# Altium schematic sheet Motor A Driver.SchDoc
size C; DrawnBy: Ross Harvey; Revision: A; SheetNumber: 2; ModifiedDate: 7/2/2015
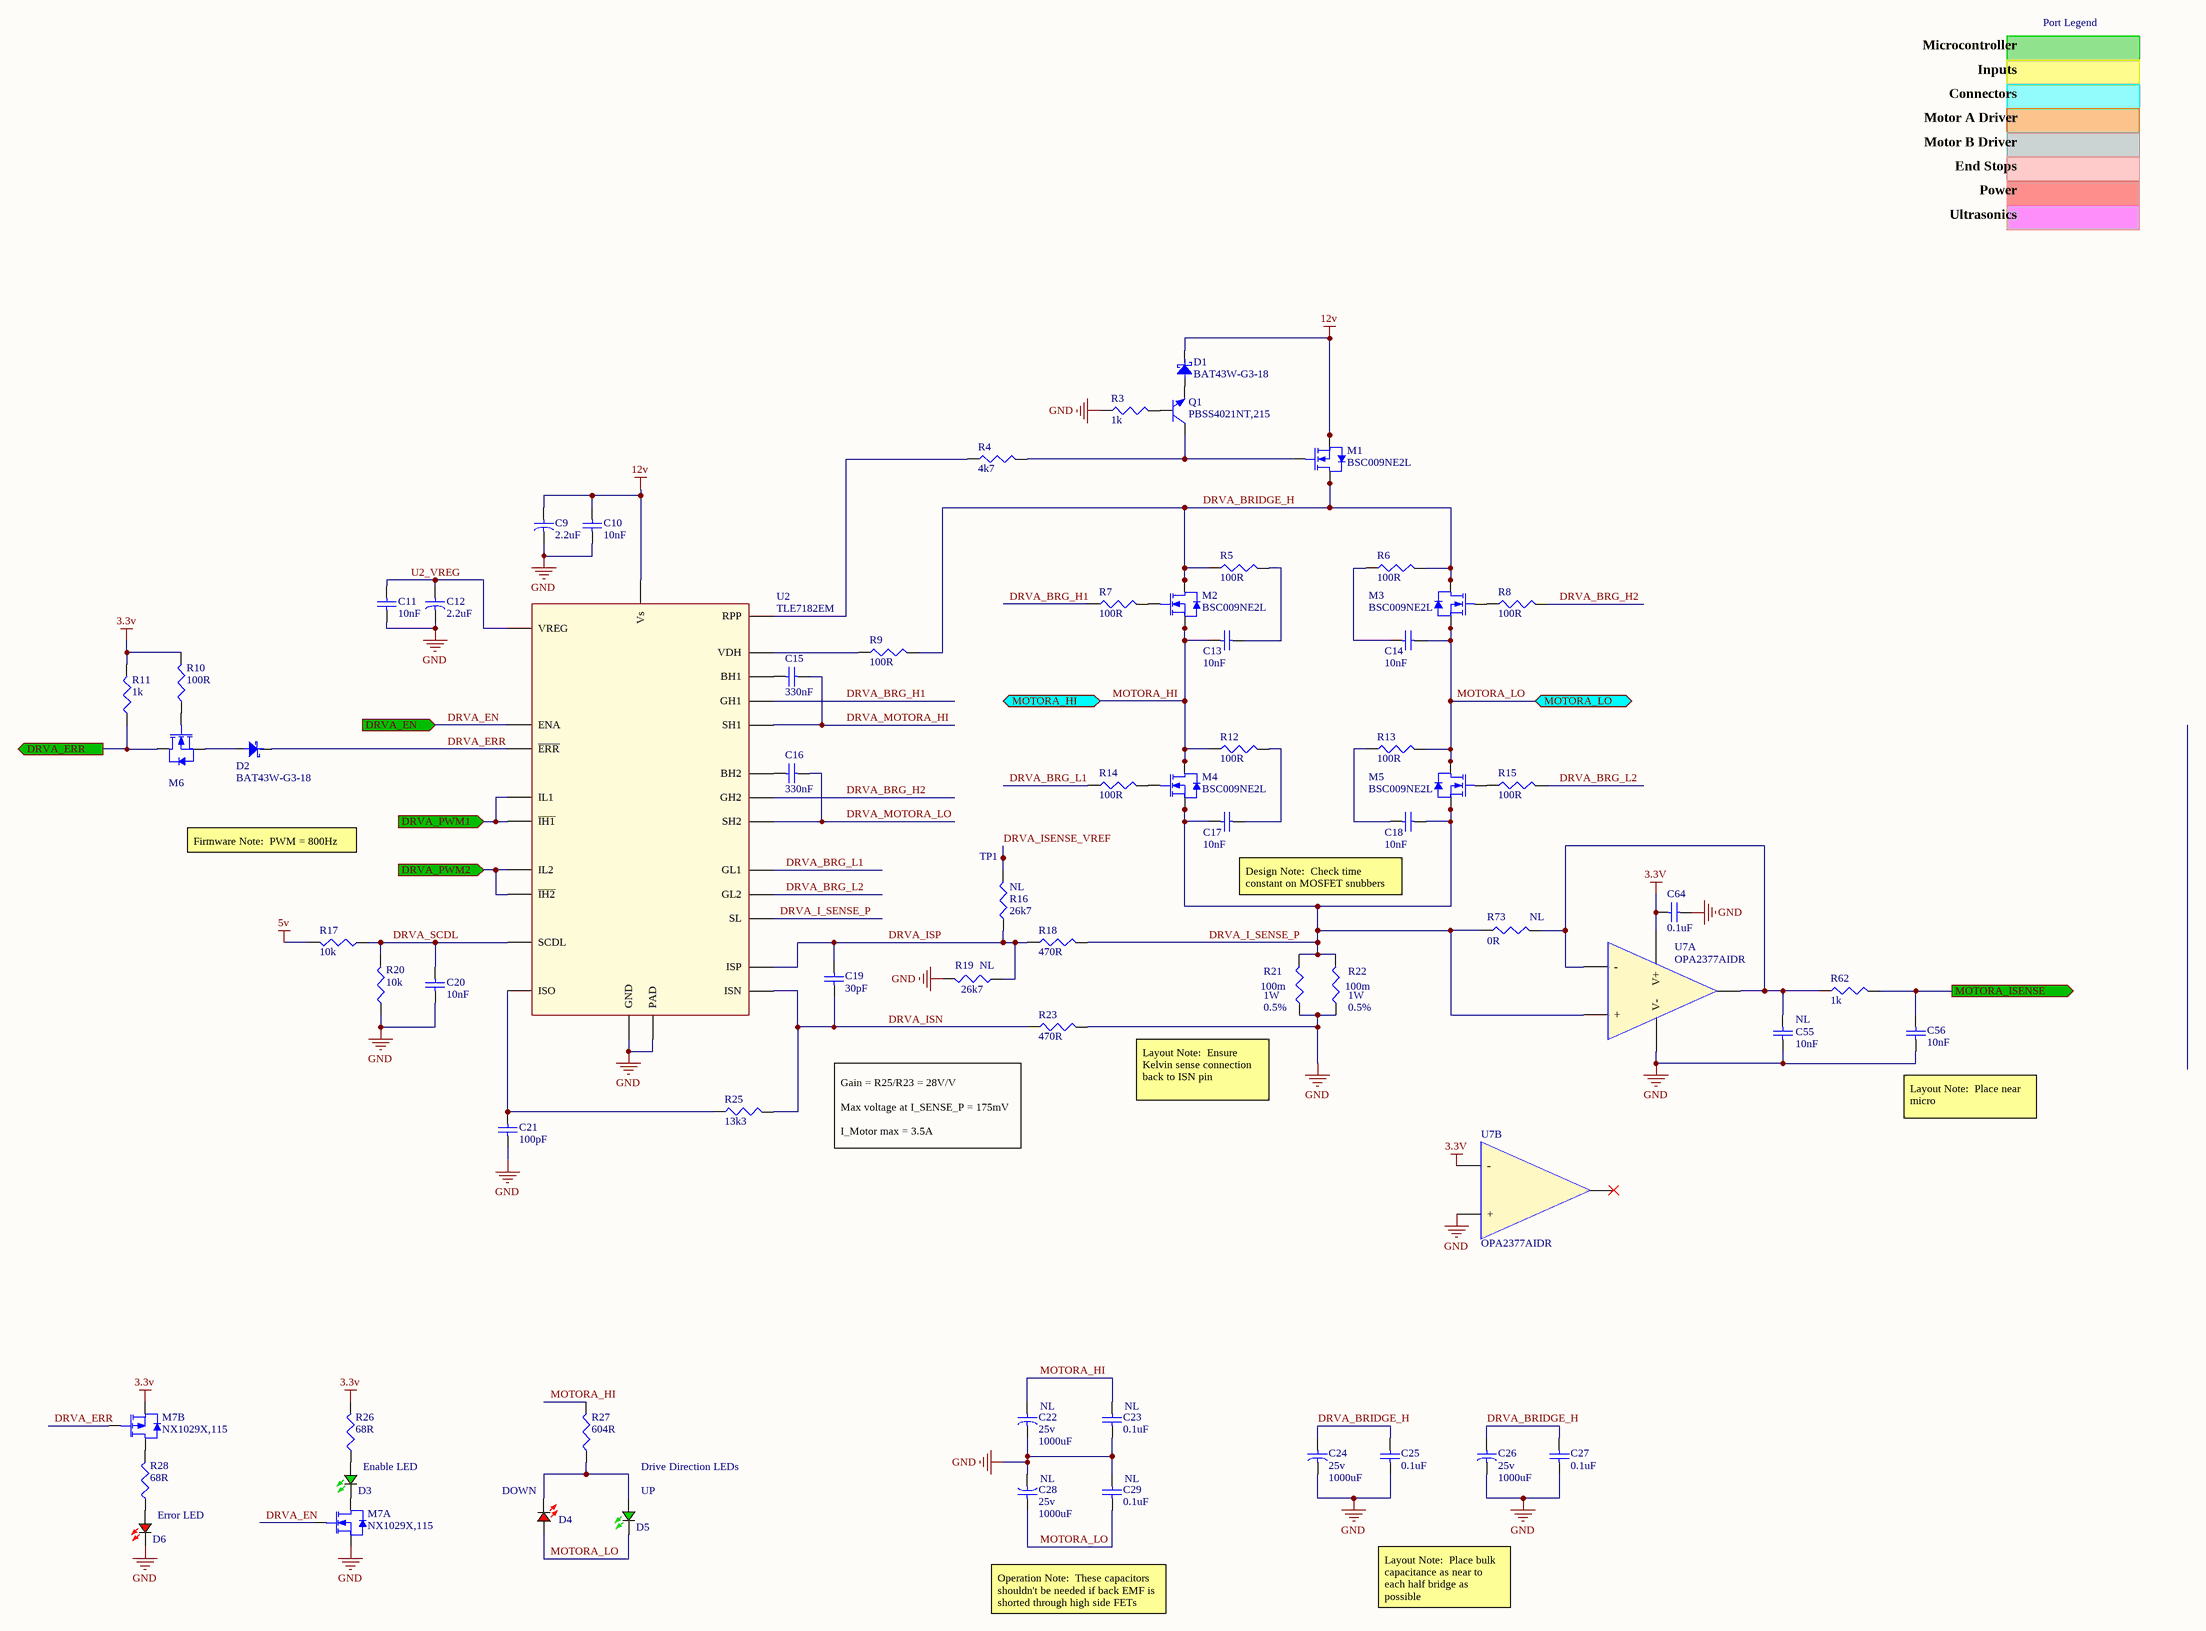
[diagram p0: Motor A Driver.SchDoc]

## Parts
C9  2.2uF  [SMD Elec Cap (5.5_5.4_4)]
C10  10nF  [CAP0603W]
C11  10nF  [CAP0603W]
C12  2.2uF  [SMD Elec Cap (5.5_5.4_4)]
C13  10nF  [CAP0603W]
C14  10nF  [CAP0603W]
C15  330nF  [CAP0805W]
C16  330nF  [CAP0805W]
C17  10nF  [CAP0603W]
C18  10nF  [CAP0603W]
C19  30pF  [CAP0603W]
C20  10nF  [CAP0603W]
C21  100pF  [CAP0603W]
C22  Voltage: 25v  LOAD: NL  [SMD Elec Cap (13.5_15_12.5)]  (hidden comment: 1000uF)
C23  LOAD: NL  [CAP0603W]  (hidden comment: 0.1uF)
C24  Voltage: 25v  [SMD Elec Cap (13.5_15_12.5)]  (hidden comment: 1000uF)
C25  0.1uF  [CAP0603W]
C26  Voltage: 25v  [SMD Elec Cap (13.5_15_12.5)]  (hidden comment: 1000uF)
C27  0.1uF  [CAP0603W]
C28  Voltage: 25v  LOAD: NL  [SMD Elec Cap (13.5_15_12.5)]  (hidden comment: 1000uF)
C29  LOAD: NL  [CAP0603W]  (hidden comment: 0.1uF)
C55  LOAD: NL  [CAP0603W]  (hidden comment: 10nF)
C56  10nF  [CAP0603W]
C64  0.1uF  [CAP0603W]
D1  BAT43W-G3-18  [SOD-123]
D2  BAT43W-G3-18  [SOD-123]
D3  LTST-S270KGKT  [LED Green 0603]  (value not drawn)
D4  VLMS1300-GS08  [LED Red 0603]  (value not drawn)
D5  LTST-S270KGKT  [LED Green 0603]  (value not drawn)
D6  VLMS1300-GS08  [LED Red 0603]  (value not drawn)
M1  BSC009NE2L  [PowerPAK-SO8]
M2  BSC009NE2L  [PowerPAK-SO8]
M3  BSC009NE2L  [PowerPAK-SO8]
M4  BSC009NE2L  [PowerPAK-SO8]
M5  BSC009NE2L  [PowerPAK-SO8]
M6  2N7002P,215  [SOT23-3M]  (value not drawn)
M7  NX1029X,115  [SOT666-6N]  (parts A,B of 2)
Q1  PBSS4021NT,215  [SOT23-3M]
R3  1k  [RES0603W]
R4  4k7  [RES0603W]
R5  100R  [RES0603W]
R6  100R  [RES0603W]
R7  100R  [RES0603W]
R8  100R  [RES0603W]
R9  100R  [RES0603W]
R10  100R  [RES0603W]
R11  1k  [RES0603W]
R12  100R  [RES0603W]
R13  100R  [RES0603W]
R14  100R  [RES0603W]
R15  100R  [RES0603W]
R16  Load: NL  [RES0603W]  (hidden comment: 26k7)
R17  10k  [RES0603W]
R18  470R  [RES0603W]
R19  Load: NL  [RES0603W]  (hidden comment: 26k7)
R20  10k  [RES0603W]
R21  POWER: 1W  Tolerance: 0.5%  [RES2512W]  (hidden comment: 100m)
R22  POWER: 1W  Tolerance: 0.5%  [RES2512W]  (hidden comment: 100m)
R23  470R  [RES0603W]
R25  13k3  [RES0603W]
R26  68R  [RES0603W]
R27  604R  [RES1206W]
R28  68R  [RES0603W]
R62  1k  [RES0603W]
R73  Load: NL  [RES0603W]  (hidden comment: 0R)
TP1  TP  [1mm Via]  (value not drawn)
U2  TLE7182EM  [PG-SSOP24]
U7  OPA2377AIDR  [SOIC-8]  (parts A,B of 2)

## Ports
DRVA_EN (in), DRVA_ERR (out), DRVA_PWM1 (in), DRVA_PWM2 (in), MOTORA_HI (bidir), MOTORA_ISENSE (out), MOTORA_LO (bidir)

## Nets
3.3v: C64.1 M7.4(S2) R10.2 R11.2 R26.2 U7.6(-) U7.8(V+)
5v: R17.2
12v: C9.2 C10.1 D1.1(K) M1.1(SOURCE) M1.2(SOURCE) M1.3(SOURCE) U2.7(Vs)
GND: C9.1 C10.2 C11.2 C12.1 C20.2 C21.2 C22.1 C23.2 C24.1 C25.2 C26.1 C27.2 C28.1 C29.1 C55.2 C56.2 C64.2 D6.1(K) M7.1(S1) R3.1 R19.2 R20.1 R21.1 R22.1 R23.2 U2.19(GND) U2.25(PAD) U7.4(V-) U7.5(+)
DRVA_BRG_H1: R7.1 U2.23(GH1)
DRVA_BRG_H2: R8.2 U2.2(GH2)
DRVA_BRG_L1: R14.1 U2.21(GL1)
DRVA_BRG_L2: R15.2 U2.4(GL2)
DRVA_BRIDGE_H: C24.2 C25.1 C26.2 C27.1 M1.5(DRAIN) M1.6(DRAIN) M1.7(DRAIN) M1.8(DRAIN) M2.5(DRAIN) M2.6(DRAIN) M2.7(DRAIN) M2.8(DRAIN) M3.5(DRAIN) M3.6(DRAIN) M3.7(DRAIN) M3.8(DRAIN) R5.1 R6.2 R9.2
DRVA_EN: M7.2(G1) U2.9(ENA) ; port DRVA_EN
DRVA_ERR: M6.3(SOURCE) R11.1 ; port DRVA_ERR
DRVA_ERR: D2.1(K) M7.5(G2) U2.17(~{ERR})  [a separate net that carries the same name]
DRVA_I_SENSE_P: C17.1 C18.2 M4.1(SOURCE) M4.2(SOURCE) M4.3(SOURCE) M5.1(SOURCE) M5.2(SOURCE) M5.3(SOURCE) R18.2 R21.2 R22.2 R73.1 U2.20(SL) U7.3(+)
DRVA_ISENSE_VREF: R16.2 TP1.1
DRVA_ISN: C19.2 R23.1 R25.2 U2.10(ISN)
DRVA_ISP: C19.1 R16.1 R18.1 R19.1 U2.11(ISP)
DRVA_MOTORA_HI: C15.2 U2.22(SH1)
DRVA_MOTORA_LO: C16.2 U2.3(SH2)
DRVA_PWM1: U2.15(~{IH1}) U2.16(IL1) ; port DRVA_PWM1
DRVA_PWM2: U2.13(~{IH2}) U2.14(IL2) ; port DRVA_PWM2
DRVA_SCDL: C20.1 R17.1 R20.2 U2.18(SCDL)
MOTORA_HI: C13.1 C22.2 C23.1 M2.1(SOURCE) M2.2(SOURCE) M2.3(SOURCE) M4.5(DRAIN) M4.6(DRAIN) M4.7(DRAIN) M4.8(DRAIN) R12.1 R27.2 ; port MOTORA_HI
MOTORA_ISENSE: C56.1 R62.2 ; port MOTORA_ISENSE
MOTORA_LO: C14.2 C28.2 C29.2 D4.2(A) D5.1(K) M3.1(SOURCE) M3.2(SOURCE) M3.3(SOURCE) M5.5(DRAIN) M5.6(DRAIN) M5.7(DRAIN) M5.8(DRAIN) R13.2 ; port MOTORA_LO
U2_VREG: C11.1 C12.2 U2.8(VREG)
NetC13_2: C13.2 R5.2
NetC14_1: C14.1 R6.1
NetC15_1: C15.1 U2.24(BH1)
NetC16_1: C16.1 U2.1(BH2)
NetC17_2: C17.2 R12.2
NetC18_1: C18.1 R13.1
NetC21_1: C21.1 R25.1 U2.12(ISO)
NetC55_1: C55.1 R62.1 R73.2 U7.1(OUTA) U7.2(-)
NetD1_2: D1.2(A) Q1.2(C)
NetD2_2: D2.2(A) M6.2(SOURCE)
NetD3_1: D3.1(K) M7.6(D1)
NetD3_2: D3.2(A) R26.1
NetD4_1: D4.1(K) D5.2(A) R27.1
NetD6_2: D6.2(A) R28.1
NetM1_4: M1.4(GATE) Q1.3(E) R4.2
NetM2_4: M2.4(GATE) R7.2
NetM3_4: M3.4(GATE) R8.1
NetM4_4: M4.4(GATE) R14.2
NetM5_4: M5.4(GATE) R15.1
NetM6_1: M6.1(GATE) R10.1
NetM7_3: M7.3(D2) R28.2
NetQ1_1: Q1.1(B) R3.2
NetR4_1: R4.1 U2.6(RPP)
NetR9_1: R9.1 U2.5(VDH)

Not connected (* = marked no-connect by the designer): U7 7(OUTB)*

## Notes on the sheet
- Microcontroller
- Port Legend
- Inputs
- Connectors
- Motor A Driver
- Motor B Driver
- End Stops
- Power
- Ultrasonics
- Firmware Note:  PWM = 800Hz
- Design Note:  Check time constant on MOSFET snubbers
- (near R23) Gain = R25/R23 = 28V/V
  Max voltage at I_SENSE_P = 175mV
  I_Motor max = 3.5A
- Layout Note:  Ensure Kelvin sense connection back to ISN pin
- (near C56) Layout Note:  Place near micro
- Enable LED
- (near D4) DOWN
- Drive Direction LEDs
- (near D5) UP
- Error LED
- Operation Note:  These capacitors shouldn't be needed if back EMF is shorted through high side FETs
- Layout Note:  Place bulk capacitance as near to each half bridge as possible

## Library data of the parts
C9 C12 = 2.2uF/35v: Tolerance: 20%; MFG1_PN: EEE-FC1V2R2AR; MFG1: PANASONIC; Voltage: 35v; Value: 2.2uF
C10 C11 C13 C14 C17 C18 C20 C55 C56 = 10nF: MFG1_PN: VJ0603Y103KXAAC; MFG1: Vishay; Value: 10nF
C15 C16 = 330nF: MFG1_PN: VJ0805V334ZXAPW1BC; MFG1: Vishay; Voltage: 50v; Value: 330nF
C19 = 30pF: MFG1_PN: VJ0805A300JXBAT; MFG1: Vishay; Value: 30pF
C21 = 100pF: MFG1_PN: VJ0603A101JNAAO; MFG1: Vishay; Voltage: 50v; Value: 100pF
C22 C24 C26 C28 = 1000uF 25v: Tolerance: 20%; MFG1_PN: EEV-FK1E102Q; MFG1: PANASONIC; Value: 1000uF
C23 C25 C27 C29 C64 = 0.1uF: MFG1_PN: VJ0603Y104JXJPW1BC; MFG1: Vishay; Value: 0.1uF
D1 D2 = BAT43: MFG: Vishay; Value: *; MFG_PN: BAT43W-G3-18
D3 D5 = LED Green 0603: MFG: Lite On; VFORWARD: 2v; CURRENT: 20mA; COLOR: Green; MFG_PN: LTST-S270KGKT
D4 D6 = LED Red 0603: MFG: Vishay; VFORWARD: 2V; CURRENT: 20mA; COLOR: Red; MFG_PN: VLMS1300-GS08
M1-M5 = BSC009NE2L: NFET_SINGLE_100A_25v; LOAD: NL; MFG: INFINEON; VDS_MAX: 25v; I_MAX: 100A; VGS_MAX: 16; P_MAX: 74W; RDS_ON: 1.25m; MFG_PN: BSC009NE2LS5ATMA1
M6 = 2N7002: NFET_SINGLE_360mA_60V; LOAD: NL; MFG: NXP; VDS_MAX: 60v; I_MAX: 360mA; VGS_MAX: 20v; P_MAX: *; RDS_ON: *; MFG_PN: 2N7002P,215
M7 = NX1029X: Complementary P/NFET; MFG: NXP; VDS_P: -50v; VDS_N: 60v; VGS: 20v; ID_P: -170mA; ID_N: 330mA; MFG_PN: NX1029X,115
Q1 = PBSS4021NT: NPN_SINGLE_8A_20v; MFG: NXP; VCE_MAX: 20v; IMAX: 8A; LOAD: NL; MFG_PN: PBSS4021NT,215
R3 R11 R62 = 1k (0603): Tolerance: 1%; POWER: 0.1W; MFG_PN: CRCW06031K00FKEA; MFG: Vishay; Load: NL; Value: 1k
R4 = 4k7 (0603): Tolerance: 1%; POWER: 0.1W; MFG_PN: CRCW06034K70FKEA; MFG: Vishay; Load: NL; Value: 4k7
R5-R10 R12-R15 = 100R (0603): Tolerance: 1%; POWER: 0.1W; MFG_PN: CRCW0603100RFKEA; MFG: Vishay; Load: NL; Value: 100R
R16 R19 = 26k7 (0603): Tolerance: 1%; POWER: 0.1W; MFG_PN: CRCW060326K7FKEA; MFG: Vishay; Value: 26k7
R17 R20 = 10K (0603): Tolerance: 1%; POWER: 0.1W; MFG_PN: CRCW060310K0FKEA; MFG: Vishay; Load: NL; Value: 10k
R18 R23 = 470R (0603): Tolerance: 1%; POWER: 0.1W; MFG_PN: CRCW0603470RFKEA; MFG: Vishay; Load: NL; Value: 470R
R21 R22 = 100mR 0.5% (2512): MFG_PN: WSL2512R1000DEA; MFG: Vishay; Load: NL; Value: 100m
R25 = 13k3 (0603): Tolerance: 1%; POWER: 0.1W; MFG_PN: CRCW060313K3FKEA; MFG: Vishay; Load: NL; Value: 13k3
R26 R28 = 68R (0603): Tolerance: 1%; POWER: 0.1W; MFG_PN: CRCW060368R0FKEB; MFG: Vishay; Load: NL; Value: 68R
R27 = 604R (1206): POWER: 0.5W; MFG_PN: CRCW1206604RFKEAHP; MFG: VISHAY; Load: NL; Tolerance: 1%; Value: 604R
R73 = 0R (0603): MFG_PN: CRCW12060000Z0EA; MFG: Vishay; Value: 0R
TP1 = Testpoint - Via 1mm
U2 = TLE7182: Full Bridge Gate Driver; MFG: INFINEON; LOAD: NL; MFG_PN: TLE7182EM
U7 = OPA2377AIDR: OpAmp - 2 Channel; LOAD: NL; MFG: TI; CHANNELS: 2; GBP: 5MHz; SINGLE_SUPPLY: TRUE; VMAX: 5.5v; OFFSET_VOLTAGE: 1mV; MFG_PN: OPA2377AIDR